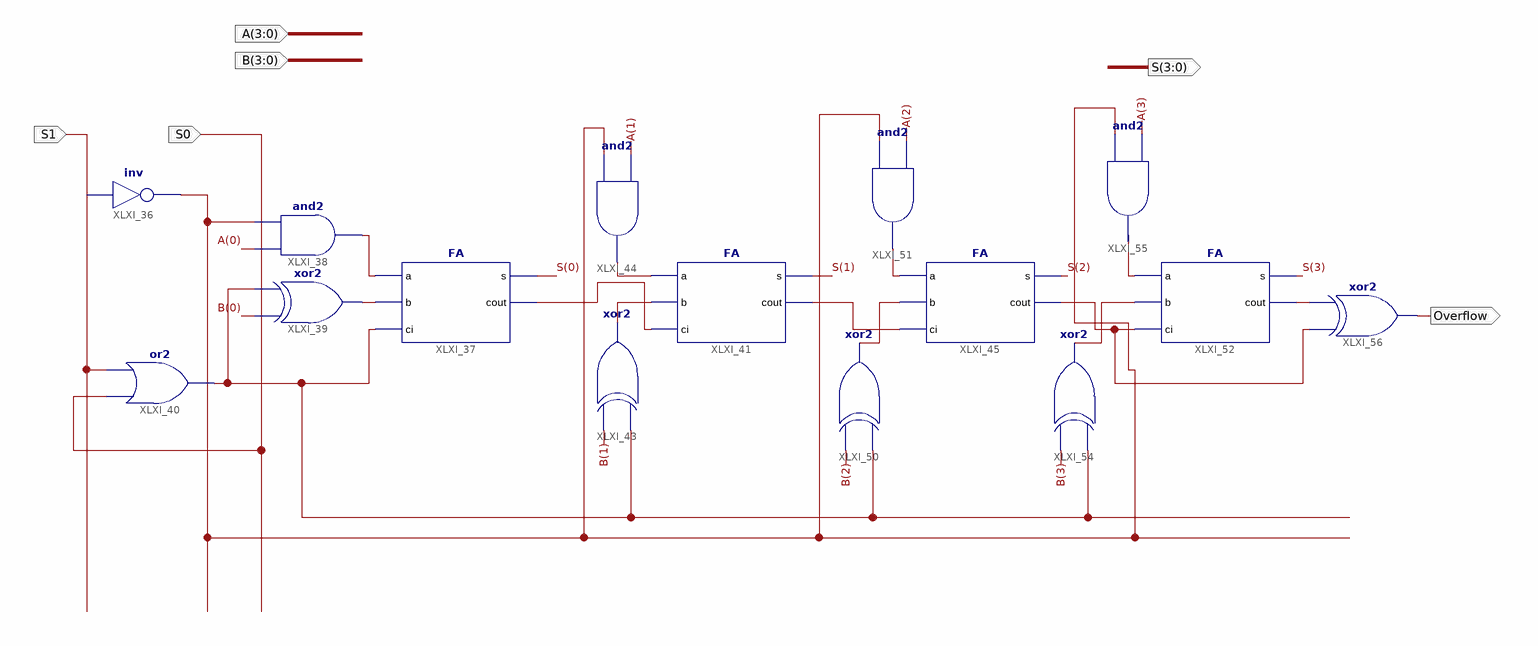
[diagram p0: schematic sheet 1]
// Xilinx ISE schematic SomaSubC2B.sch (xa9500xl) as structural Verilog: 15 symbols, 6 ports
module SomaSubC2B (
  input  S0,
  input  [3:0] A,
  input  [3:0] B,
  input  S1,
  output [3:0] S,
  output Overflow
);

  wire XLXN_142, XLXN_147, XLXN_152, XLXN_163, XLXN_169, XLXN_181, XLXN_188, XLXN_190, XLXN_193, XLXN_198,
       XLXN_199, XLXN_201, XLXN_205, XLXN_206;

  not XLXI_36 (XLXN_201, S1);
  FA XLXI_37 (.a(XLXN_142), .b(XLXN_147), .ci(XLXN_152), .s(S[0]), .cout(XLXN_181));
  and XLXI_38 (XLXN_142, A[0], XLXN_201);
  xor XLXI_39 (XLXN_147, B[0], XLXN_152);
  or XLXI_40 (XLXN_152, S0, S1);
  FA XLXI_41 (.a(XLXN_169), .b(XLXN_163), .ci(XLXN_181), .s(S[1]), .cout(XLXN_188));
  xor XLXI_43 (XLXN_163, XLXN_152, B[1]);
  and XLXI_44 (XLXN_169, XLXN_201, A[1]);
  FA XLXI_45 (.a(XLXN_190), .b(XLXN_193), .ci(XLXN_188), .s(S[2]), .cout(XLXN_205));
  xor XLXI_50 (XLXN_193, XLXN_152, B[2]);
  and XLXI_51 (XLXN_190, XLXN_201, A[2]);
  FA XLXI_52 (.a(XLXN_198), .b(XLXN_199), .ci(XLXN_205), .s(S[3]), .cout(XLXN_206));
  xor XLXI_54 (XLXN_199, XLXN_152, B[3]);
  and XLXI_55 (XLXN_198, XLXN_201, A[3]);
  xor XLXI_56 (Overflow, XLXN_205, XLXN_206);
endmodule
